# EAGLE design db9smt (EAGLE 8.1.0)
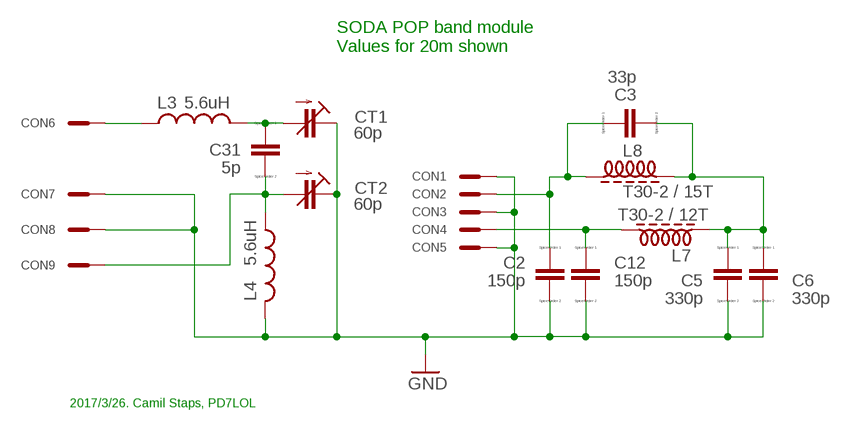
[diagram p0: schematic, sheet 1]

## Parts
C2  150p  CC0603  [C0603]
C3  33p  CC0603  [C0603]
C5  330p  CC0603  [C0603]
C6  330p  CC0603  [C0603]
C12  150p  CC0603  [C0603]
C31  5p  CC0603  [C0603]
CON1  PADONPRINT  [PAD]
CON2  PADONPRINT  [PAD]
CON3  PADONPRINT  [PAD]
CON4  PADONPRINT  [PAD]
CON5  PADONPRINT  [PAD]
CON6  PADONPRINT  [PAD]
CON7  PADONPRINT  [PAD]
CON8  PADONPRINT  [PAD]
CON9  PADONPRINT  [PAD]
CT1  60p  C-TRIMMTZ03  [CTRIMTZ03]
CT2  60p  C-TRIMMTZ03  [CTRIMTZ03]
L3  5.6uH  L-USL2012C  [L2012C]
L4  5.6uH  L-USL2012C  [L2012C]
L7  T30-2 / 12T  INDUCTORT30-2-28AWG-15T  [T30-2-28AWG-15T]
L8  T30-2 / 15T  INDUCTORT30-2-28AWG-15T  [T30-2-28AWG-15T]

## Nets
GND: C2.2 C5.2 C6.2 C12.2 CON1.P$1 CON3.P$1 CON5.P$1 CON7.P$1 CON8.P$1 CT1.1(E) CT2.1(E) L4.2
N$1: C31.2 CON9.P$1 CT2.2(A) L4.1
N$2: C31.1 CT1.2(A) L3.2
N$3: CON6.P$1 L3.1
N$4: C2.1 C3.1 CON2.P$1 L8.P$1
N$5: C12.1 CON4.P$1 L7.P$2
N$6: C3.2 C5.1 C6.1 L7.P$1 L8.P$2

## Notes on the sheet
- SODA POP band module
  Values for 20m shown
- 2017/3/26. Camil Staps, PD7LOL

## Library data of the parts
C2 C3 C5 C6 C12 C31 = eagle-ltspice:C: CAPACITOR, European symbol; SPICEMODEL: NONE; SPICEPREFIX: C
CON1-CON9 = db:PAD: PAD
CT1 CT2 = rcl:C-TRIMM: Trimm capacitor
L3 L4 = rcl:L-US: INDUCTOR, American symbol
L7 L8 = toroids:INDUCTOR: Inductor on toroid

## Board
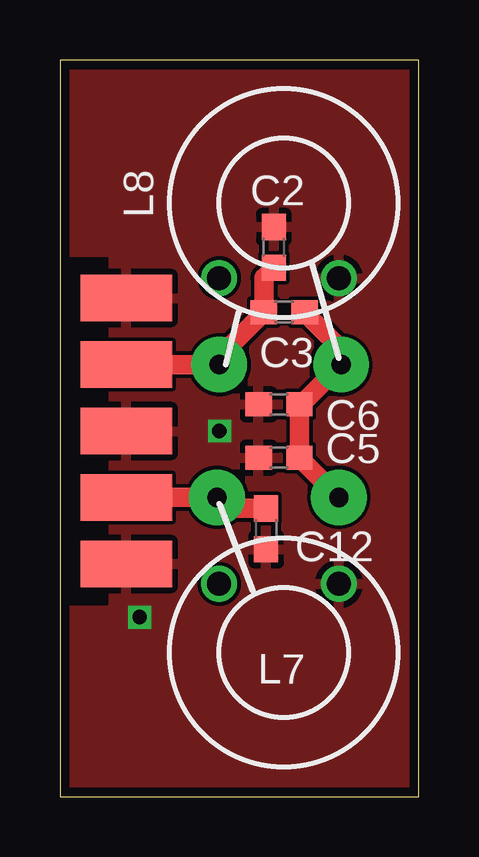
[diagram p1: board, top side]
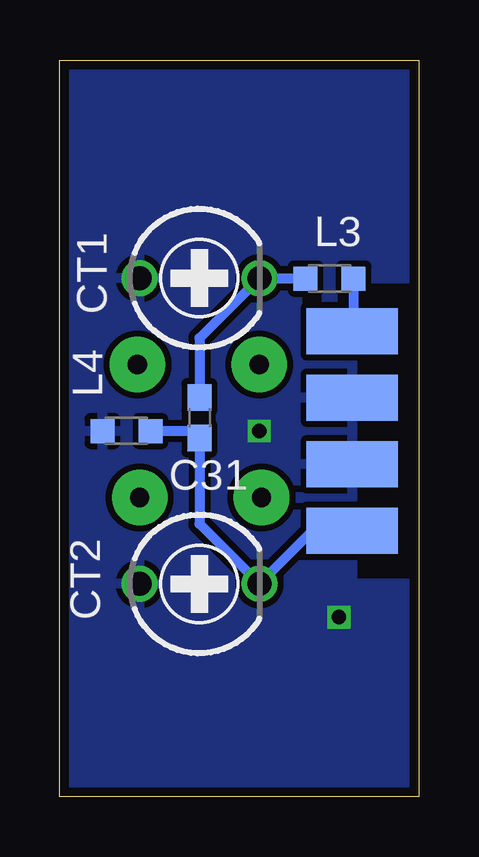
[diagram p2: board, bottom side, seen from below]

Size 14.96 x 30.69 mm. Coordinates in mm from the lower left corner, seen from the top.
Outline: 0,0 14.96,0 14.96,30.69 0,30.69 0,0
Copper layers (1*16): Top 0.0356mm / dielectric 1.5011mm / Bottom 0.0356mm
Design rules "oshpark-2layer": minimum track width 6mil, minimum drill 13mil, track to track 6mil, track to pad 6mil, pad to pad 6mil, via to via 6mil, smd to smd 6mil, copper to edge 15mil, drill to drill 6mil, minimum pad ring 7mil, minimum via ring 7mil, stop-mask expansion 2.5mil, vias tented up to drill 0mil, thermal gap 10mil

### Footprints (pad centres in the part's own frame; a part is rotated, then mirrored left to right if it is on the bottom)
C0603 = smd 1.1 x 1: 1 -0.85,0; 2 0.85,0
PAD = smd 3.81 x 1.93: P$1 0,0
CTRIMTZ03 = drill 1: 1 0,2.5; 2 0,-2.5
L2012C = smd 1 x 1: 1 -1,0; 2 1,0
T30-2-28AWG-15T = drill 0.8 pad 2.32: P$1 0,0; P$2 5.08,0

### Placement (x,y rotation side)
C2  8.92,22.89 90 top
C3  9.36,20.19 0 top
C5  9.14,14.13 180 top
C6  9.14,16.34 180 top
C12  8.6,11.16 270 top
C31  9.14,15.79 270 bottom
CON1  2.77,20.77 0 top
CON2  2.77,18 0 top
CON3  2.77,15.23 0 top
CON4  2.77,12.46 0 top
CON5  2.77,9.7 0 top
CON6  2.77,19.39 0 bottom
CON7  2.77,16.62 0 bottom
CON8  2.77,13.85 0 bottom
CON9  2.77,11.08 0 bottom
CT1  9.14,21.61 90 bottom
CT2  9.14,8.86 90 bottom
L3  3.71,21.58 180 bottom
L4  12.19,15.23 180 bottom
L7  11.63,12.46 180 top
L8  6.65,18 0 top

### Tracks (layer width: path | path; a pad name or v marks a point on that pad's centre or on a via)
GND  (via drill 0.6)
  other vias: 6.65,15.23 3.32,7.48
  pour Bottom (isolate 0.254): 0,30.75 14.96,30.75 14.96,0 0,0 0,8.86 2.77,8.86 2.77,21.61 0,21.61
  pour Top: 0,30.75 0,22.71 2.22,22.71 2.22,7.76 0,7.76 0,0 14.96,0 14.96,30.75
N$1
  Bottom 0.406: L4.1 9.44,15.23 C31.2 9.14,11.36 CT2.2 4.42,11.08 CON9.P$1
N$2
  Bottom 0.406: L3.2 6.62,21.58 CT1.2 9.14,19.11 C31.1
N$3
  Bottom 0.406: L3.1 2.71,19.45 CON6.P$1
N$4
  Top 0.813: CON2.P$1 L8.P$1 6.65,18.33 C3.1 8.51,21.62 C2.1
N$5
  Top 0.813: CON4.P$1 L7.P$2 | L7.P$2 6.65,12.56 | L7.P$2 6.73,12.29 | L7.P$2 7.01,12.01 C12.1
N$6
  Top 0.813: C3.2 11.73,18.66 L8.P$2 9.99,16.27 C6.1 C5.1 11.63,12.48 L7.P$1